# Altium schematic sheet SpectrumAnalyzer.SchDoc
size A4
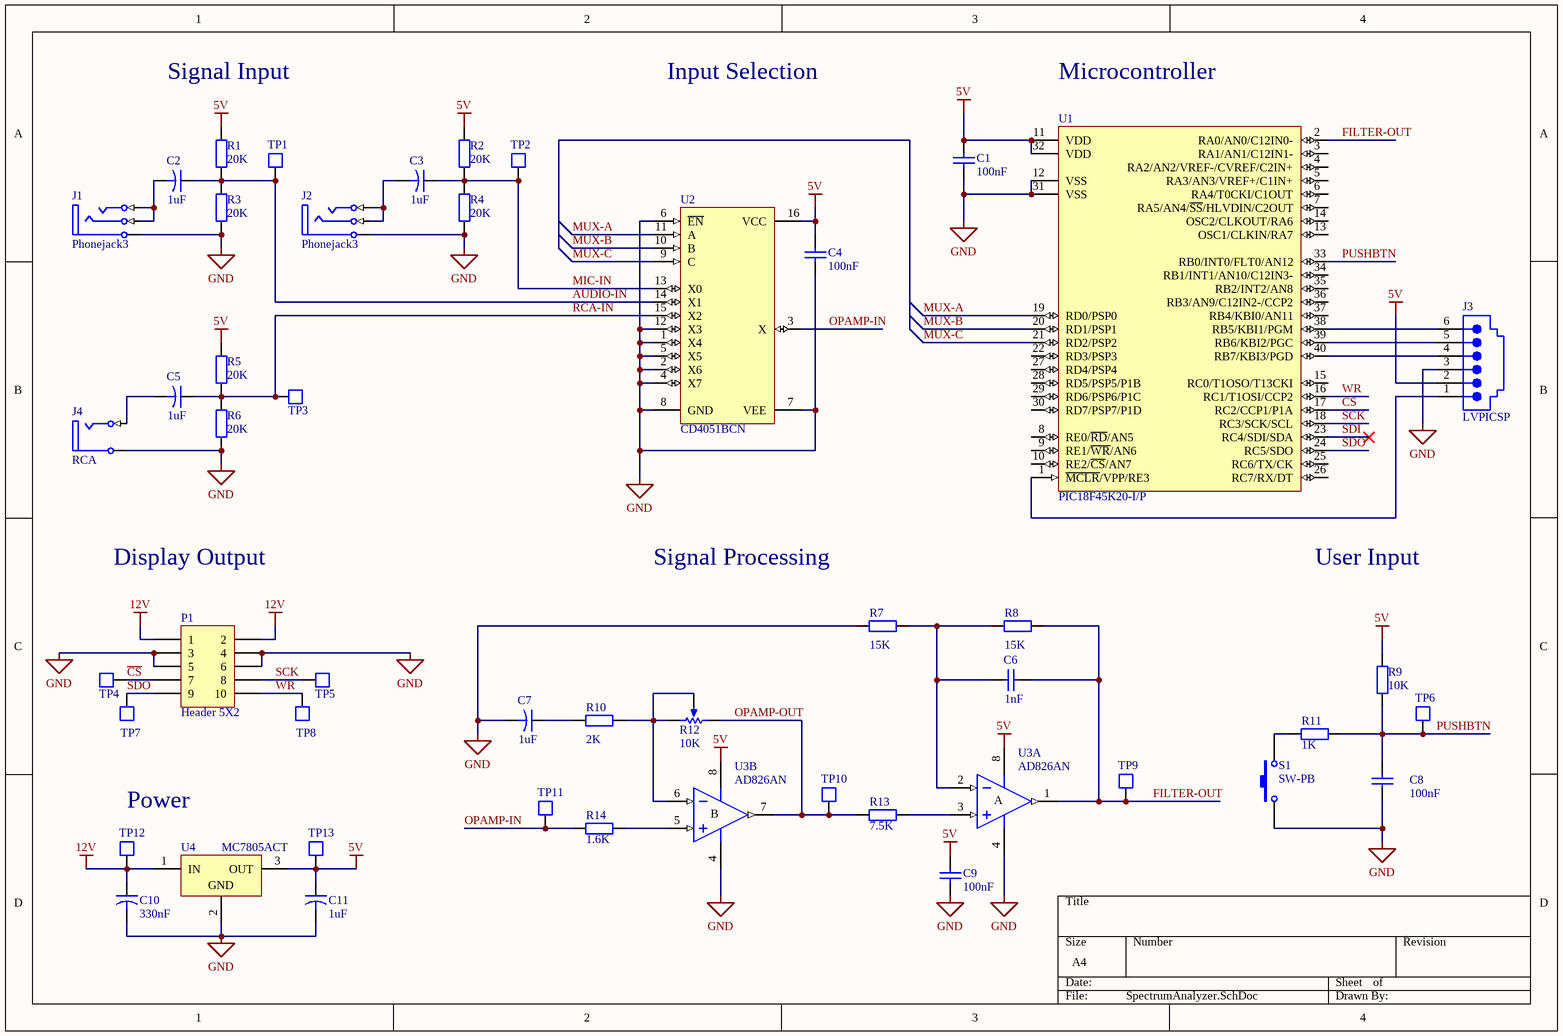
[diagram p0: SpectrumAnalyzer.SchDoc]

## Parts
C1  value 100nF  [RAD-0.3]  (hidden comment: Cap)
C2  value 1uF  [CAPR5-4X5]  (hidden comment: Cap2)
C3  value 1uF  [CAPR5-4X5]  (hidden comment: Cap2)
C4  value 100nF  [RAD-0.3]  (hidden comment: Cap)
C5  value 1uF  [CAPR5-4X5]  (hidden comment: Cap2)
C6  value 1nF  [RAD-0.3]  (hidden comment: Cap)
C7  value 1uF  [CAPR5-4X5]  (hidden comment: Cap2)
C8  value 100nF  [RAD-0.3]  (hidden comment: Cap)
C9  value 100nF  [RAD-0.3]  (hidden comment: Cap)
C10  value 330nF  [CAPR5-4X5]  (hidden comment: Cap2)
C11  value 1uF  [CAPR5-4X5]  (hidden comment: Cap2)
J1  Phonejack3  [JACK/6-V3]
J2  Phonejack3  [JACK/6-V3]
J3  LVPICSP  [95001-2661]
J4  RCA  [RCA/4.5-H2]
P1  Header 5X2  [HDR2X5]
R1  value 20K  [AXIAL-0.4]  (hidden comment: Res2)
R2  value 20K  [AXIAL-0.4]  (hidden comment: Res2)
R3  value 20K  [AXIAL-0.4]  (hidden comment: Res2)
R4  value 20K  [AXIAL-0.4]  (hidden comment: Res2)
R5  value 20K  [AXIAL-0.4]  (hidden comment: Res2)
R6  value 20K  [AXIAL-0.4]  (hidden comment: Res2)
R7  value 15K  [AXIAL-0.4]  (hidden comment: Res2)
R8  value 15K  [AXIAL-0.4]  (hidden comment: Res2)
R9  value 10K  [AXIAL-0.4]  (hidden comment: Res2)
R10  value 2K  [AXIAL-0.4]  (hidden comment: Res2)
R11  value 1K  [AXIAL-0.4]  (hidden comment: Res2)
R12  value 10K  [VR5]  (hidden comment: RPot)
R13  value 7.5K  [AXIAL-0.4]  (hidden comment: Res2)
R14  value 1.6K  [AXIAL-0.4]  (hidden comment: Res2)
S1  SW-PB  [SPST-2]
TP1  Test Pad  [PIN1]  (value not drawn)
TP2  Test Pad  [PIN1]  (value not drawn)
TP3  Test Pad  [PIN1]  (value not drawn)
TP4  Test Pad  [PIN1]  (value not drawn)
TP5  Test Pad  [PIN1]  (value not drawn)
TP6  Test Pad  [PIN1]  (value not drawn)
TP7  Test Pad  [PIN1]  (value not drawn)
TP8  Test Pad  [PIN1]  (value not drawn)
TP9  Test Pad  [PIN1]  (value not drawn)
TP10  Test Pad  [PIN1]  (value not drawn)
TP11  Test Pad  [PIN1]  (value not drawn)
TP12  Test Pad  [PIN1]  (value not drawn)
TP13  Test Pad  [PIN1]  (value not drawn)
U1  PIC18F45K20-I/P  [PDIP600-P40]
U2  CD4051BCN  [N16E]
U3  AD826AN  [N-8]  (parts A,B of 2)
U4  MC7805ACT  [221A-04]

## Nets
5V: C1.1 C4.1 C9.1 C11.1 J3.2 R1.2 R2.2 R5.2 R9.2 TP13.1 U1.11(VDD) U1.32(VDD) U2.16(VCC) U3.8(V+) U4.3(OUT)
12V: C10.1 P1.1 P1.2 TP12.1 U4.1(IN)
GND: C1.2 C4.2 C7.2 C8.1 C9.2 C10.2 C11.2 J1.5(S) J2.5(S) J3.3 J4.1A(Ground) P1.3 P1.4 P1.5 P1.6 R3.1 R4.1 R6.1 R7.1 S1.1 U1.12(VSS) U1.31(VSS) U2.1(X4) U2.2(X6) U2.4(X7) U2.5(X5) U2.6(~{EN}) U2.7(VEE) U2.8(GND) U2.12(X3) U3.4(V-) U4.2(GND)
AUDIO-IN: C2.1 R1.1 R3.2 TP1.1 U2.14(X1)
~{CS}: P1.7 TP4.1 U1.17(RC2/CCP1/P1A)
FILTER-OUT: C6.2 R8.2 TP9.1 U1.2(RA0/AN0/C12IN0-) U3.1(OUT)
MIC-IN: C3.1 R2.1 R4.2 TP2.1 U2.13(X0)
MUX-A: U1.19(RD0/PSP0) U2.11(A)
MUX-B: U1.20(RD1/PSP1) U2.10(B)
MUX-C: U1.21(RD2/PSP2) U2.9(C)
OPAMP-IN: R14.2 TP11.1 U2.3(X)
OPAMP-OUT: R12.1(TOP) R13.2 TP10.1 U3.7(OUT)
PUSHBTN: C8.2 R9.1 R11.2 TP6.1 U1.33(RB0/INT0/FLT0/AN12)
RCA-IN: C5.1 R5.1 R6.2 TP3.1 U2.15(X2)
SCK: P1.8 TP5.1 U1.18(RC3/SCK/SCL)
SDI: U1.23(RC4/SDI/SDA)
SDO: P1.9 TP7.1 U1.24(RC5/SDO)
WR: P1.10 TP8.1 U1.16(RC1/T1OSI/CCP2)
NetC2_2: C2.2 J1.1(T) J1.3(R)
NetC3_2: C3.2 J2.1(T) J2.3(R)
NetC5_2: C5.2 J4.2B(Signal)
NetC6_1: C6.1 R7.2 R8.1 U3.2(IN-)
NetC7_1: C7.1 R10.1
NetJ3_1: J3.1 U1.1(~{MCLR}/VPP/RE3)
NetJ3_4: J3.4 U1.40(RB7/KBI3/PGD)
NetJ3_5: J3.5 U1.39(RB6/KBI2/PGC)
NetJ3_6: J3.6 U1.38(RB5/KBI1/PGM)
NetR10_2: R10.2 R12.2(BOT) R12.3(TAP) U3.6(IN-)
NetR11_1: R11.1 S1.2
NetR13_1: R13.1 U3.3(IN+)
NetR14_1: R14.1 U3.5(IN+)

Not connected (* = marked no-connect by the designer): U1 3(RA1/AN1/C12IN1-) 4(RA2/AN2/VREF-/CVREF/C2IN+) 5(RA3/AN3/VREF+/C1IN+) 6(RA4/T0CKI/C1OUT) 7(RA5/AN4/~{SS}/HLVDIN/C2OUT) 8(RE0/~{RD}/AN5) 9(RE1/~{WR}/AN6) 10(RE2/~{CS}/AN7) 13(OSC1/CLKIN/RA7) 14(OSC2/CLKOUT/RA6) 15(RC0/T1OSO/T13CKI) 22(RD3/PSP3) 25(RC6/TX/CK) 26(RC7/RX/DT) 27(RD4/PSP4) 28(RD5/PSP5/P1B) 29(RD6/PSP6/P1C) 30(RD7/PSP7/P1D) 34(RB1/INT1/AN10/C12IN3-) 35(RB2/INT2/AN8) 36(RB3/AN9/C12IN2-/CCP2) 37(RB4/KBI0/AN11)

## Notes on the sheet
- Signal Input
- Input Selection
- Microcontroller
- Display Output
- Signal Processing
- User Input
- Power
- (in symbol AD826AN, part A) A
- (in symbol AD826AN, part B) B

## Library data of the parts
C1 C4 C6 C8 C9 = Cap: Capacitor; Published: 8-Jun-2000; LatestRevisionDate: 17-Jul-2002; LatestRevisionNote: Re-released for DXP Platform.; PackageReference: RAD-0.3; Publisher: Altium Limited; PackageDescription: Radial Cap, Thru-Hole; 2 Leads; 0.3 in Pin Spacing
C2 C3 C5 C7 C10 C11 = Cap2: Capacitor; Published: 23-Sep-2002; PackageReference: CAPR5-4X5; Publisher: Altium Limited; PackageDescription: Capacitor; 2 Leads
J1 J2 = Phonejack3: Jack Socket, 1/4" [6.5mm], Thru-Hole, Vertical, 3-Conductor Open Circuit (Non-Normalling); PackageDocument: 2003; PCB_Layout: Complies with manufacturer's recommendation.; DrillAndSlotSize: Corresponds to nominal value.; Published: 15-Jul-2004; LatestRevisionDate: 15-Jul-2004; LatestRevisionNote: Component Replaced.; DatasheetDocument: 2003; PackageReference: S1VS_SSS; Publisher: Altium Limited; ComponentLink1Description: Manufacturer Link; ComponentLink1URL: http://www.cliffuk.co.uk/
J3 = 95001-2661: Right Angle, Low Profile, Flangeless PCB Jack; Ports: 1; Positions/Loaded: Port1 - 6/6; PerformanceCategory: 3; PCB_Mounting: Thru-Hole; DrillSize: Nominal, Rounded to nearest 0.05mm; PCB_Layout: Complies with Manufacturer's Recommendation.; Published: 25-Jun-2002; DatasheetDocument: 17-Dec-2001; PackageDocument: 17-Dec-2001; PackageReference: 95001-2661; Publisher: Altium Limited; ComponentLink1Description: Manufacturer Link; ComponentLink1URL: http://www.molex.com/; ComponentLink2Description: Datasheet; ComponentLink2URL: http://www.molex.com/cmc_upload/common_files/1222003_mx95001b.pdf; ComponentLink3Description: Iges Model; ComponentLink3URL: http://www.molex.com/pdm_docs/igs/95001-2441_igs.zip
J4 = RCA: RCA Phono Jack, Right Angle, Thru-Hole, Snap-In; PCB_Layout: Complies with manufacturer's recommendation.; DrillAndSlotSize: Corresponds to nominal value.; Published: 15-Jul-2004; LatestRevisionDate: 15-Jul-2004; LatestRevisionNote: Component Replaced.; DatasheetDocument: 7-Jul-2000; PackageDocument: 7-Jul-2000; PackageReference: 161; Publisher: Altium Limited; ComponentLink1Description: Manufacturer Link; ComponentLink1URL: http://www.mouser.com/kobiconn/
P1 = Header 5X2: Header, 5-Pin, Dual row; LatestRevisionDate: 17-Jul-2002; LatestRevisionNote: Re-released for DXP Platform.; Publisher: Altium Limited
R1-R11 R13 R14 = Res2: Resistor; Published: 8-Jun-2000; LatestRevisionDate: 17-Jul-2002; LatestRevisionNote: Re-released for DXP Platform.; PackageReference: AXIAL-0.4; Publisher: Altium Limited; PackageDescription: Axial Device, Thru-Hole; 2 Leads; 0.4 in Pin Spacing
R12 = RPot: Potentiometer; Sim Note: Enter the Resistance value and the set point into parameter fields.; Set Position: 0.5; Published: 8-Jun-2000; LatestRevisionDate: 17-Jul-2002; LatestRevisionNote: Re-released for DXP Platform.; PackageReference: VR5; Publisher: Altium Limited; PackageDescription: Variable Resistor, Thru-Hole; 3 Leads
S1 = SW-PB: Switch; Published: 24-Mar-1999; LatestRevisionDate: 17-Jul-2002; LatestRevisionNote: Re-released for DXP Platform.; PackageReference: SPST-2; Publisher: Altium Limited; PackageDescription: Switch; 2 Leads
TP1-TP13 = TestPad
U1 = PIC18F45K20-I/P: Flash Microcontroller with 10-Bit A/D and nanoWatt Technology, 32K Flash, 40-Pin PDIP, Industrial Temperature Range; Published: 29-Jan-2009; LatestRevisionDate: 02-Dec-2009; LatestRevisionNote: Updated to datasheet revision F, Sep-2009; DatasheetVersion: revF, Sep-2009; PackageVersion: revBB, Aug-2009; PackageReference: PDIP600-P40; Publisher: Altium Limited; PackageDescription: 40-Lead Plastic Dual In-Line (P) - 600 mil Body [PDIP]; Supplier 1: Digi-Key; Supplier Part Number 1: PIC18F45K20-I/P-ND; Supplier 2: Farnell; Supplier Part Number 2: 1439588; ComponentLink1Description: Datasheet; ComponentLink1URL: http://ww1.microchip.com/downloads/en/DeviceDoc/41303F.pdf; ComponentLink2Description: Packaging Specification; ComponentLink2URL: http://www.microchip.com/stellent/groups/techpub_sg/documents/packagingspec/en012702.pdf; ComponentLink3Description: Microchip.com Home; ComponentLink3URL: http://www.microchip.com/
U2 = CD4051BCN: 8-Channel Analog Multiplexer/Demultiplexer; Published: 17-Jul-2002; LatestRevisionDate: 29-May-2009; LatestRevisionNote: Component Body Added.; DatasheetVersion: Jan-1999; PackageVersion: 2000; PackageReference: N16E; Publisher: Altium Limited; PackageDescription: DIP, 16-Pin, Row Spacing 7.62 mm, Pitch 2.54 mm; ComponentLink1Description: Manufacturer Link; ComponentLink1URL: http://www.fairchildsemi.com/; ComponentLink2Description: Datasheet; ComponentLink2URL: http://www.fairchildsemi.com/ds/CD%2FCD4052BC.pdf
U3 = AD826AN: High-Speed, Low-Power Dual Operational Amplifier; Published: 8-Jun-2000; LatestRevisionDate: 04-Mar-2005; LatestRevisionNote: Stylized 3D Model Added.; DatasheetVersion: REV. A 1995; PackageVersion: revA; PackageReference: N-8; Publisher: Altium Limited; PackageDescription: DIP; 8 Leads; Row Spacing 7.62 mm; Pitch 2.54 mm; ComponentLink1Description: Manufacturer Link; ComponentLink1URL: http://www.analog.com/en/prod/0,,759_786_AD826%2C00.html; ComponentLink2Description: Datasheet; ComponentLink2URL: http://www.analog.com/UploadedFiles/Data_Sheets/432952987AD826_b.pdf
U4 = MC7805ACT: 3-Terminal Positive Fixed Voltage Regulator; Note: Pin 2 is electrically connected to TAB; Published: 17-Jul-2002; DatasheetVersion: 1988; PackageReference: 221A-04; Publisher: Altium Limited; PackageDescription: TO, Thru-Hole, Vertical, Heatsink Mounted; 3 In-Line Leads; Pitch 2.54 mm; Code_JEDEC: TO-262-AA; ComponentLink1Description: Manufacturer Link; ComponentLink1URL: http://www.onsemi.com/site/products/taxonomy/0,4438,503,00.html; ComponentLink2Description: Datasheet; ComponentLink2URL: http://www.onsemi.com/pub/Collateral/MC7800-D.PDF